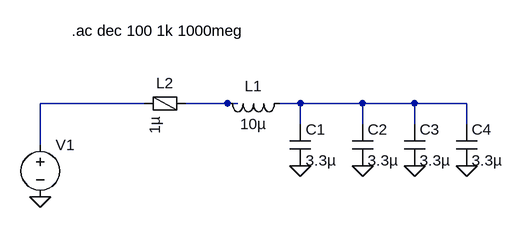
[diagram p0: schematic bias-tee.asc]
bias-tee.asc, the LTspice schematic file:
Version 4
SHEET 1 880 680
WIRE -48 304 -208 304
WIRE 80 304 16 304
WIRE 96 304 80 304
WIRE 192 304 160 304
WIRE 288 304 192 304
WIRE 368 304 288 304
WIRE 448 304 368 304
WIRE 192 336 192 304
WIRE 288 336 288 304
WIRE 368 336 368 304
WIRE 448 336 448 304
WIRE -208 368 -208 304
FLAG -208 448 0
FLAG 192 400 0
FLAG 288 400 0
FLAG 368 400 0
FLAG 448 400 0
SYMBOL voltage -208 352 R0
SYMATTR InstName V1
SYMATTR Value ""
SYMATTR Value2 AC 1
SYMBOL ind 176 288 R90
WINDOW 0 5 56 VBottom 2
WINDOW 3 32 56 VTop 2
SYMATTR InstName L1
SYMATTR Value 10µ
SYMATTR SpiceLine Ipk=830m Rser=380m Rpar=infin. Cpar=0 mfg="Murata" pn="LQH2HPN100MJRL"
SYMBOL FerriteBead -16 304 R90
WINDOW 0 -16 0 VBottom 2
SYMATTR InstName L2
SYMATTR Value 1µ
SYMATTR SpiceLine Ipk=1.5 Rser=90m Rpar=636 Cpar=836f mfg="Würth Elektronik" pn="74269262601 WE-TMSB 0603"
SYMBOL cap 176 336 R0
SYMATTR InstName C1
SYMATTR Value 3.3µ
SYMATTR SpiceLine Rser=4.2m Lser=300p mfg="Würth Elektronik" pn="885012107008 WCAP-CSGP 0805" type="X5R"
SYMBOL cap 272 336 R0
SYMATTR InstName C2
SYMATTR Value 3.3µ
SYMATTR SpiceLine Rser=4.2m Lser=300p mfg="Würth Elektronik" pn="885012107008 WCAP-CSGP 0805" type="X5R"
SYMBOL cap 352 336 R0
SYMATTR InstName C3
SYMATTR Value 3.3µ
SYMATTR SpiceLine Rser=4.2m Lser=300p mfg="Würth Elektronik" pn="885012107008 WCAP-CSGP 0805" type="X5R"
SYMBOL cap 432 336 R0
SYMATTR InstName C4
SYMATTR Value 3.3µ
SYMATTR SpiceLine Rser=4.2m Lser=300p mfg="Würth Elektronik" pn="885012107008 WCAP-CSGP 0805" type="X5R"
TEXT -160 192 Left 2 !.ac dec 100 1k 1000meg

The netlist it stands for:
* bias-tee.asc
V1 N001 0 AC 1
L1 N003 N002 10µ Ipk=830m Rser=380m Rpar=infin. Cpar=0 mfg="Murata" pn="LQH2HPN100MJRL"
L2 N002 N001 1µ Ipk=1.5 Rser=90m Rpar=636 Cpar=836f mfg="Würth Elektronik" pn="74269262601 WE-TMSB 0603"
C1 N003 0 3.3µ Rser=4.2m Lser=300p mfg="Würth Elektronik" pn="885012107008 WCAP-CSGP 0805" type="X5R"
C2 N003 0 3.3µ Rser=4.2m Lser=300p mfg="Würth Elektronik" pn="885012107008 WCAP-CSGP 0805" type="X5R"
C3 N003 0 3.3µ Rser=4.2m Lser=300p mfg="Würth Elektronik" pn="885012107008 WCAP-CSGP 0805" type="X5R"
C4 N003 0 3.3µ Rser=4.2m Lser=300p mfg="Würth Elektronik" pn="885012107008 WCAP-CSGP 0805" type="X5R"
.ac dec 100 1k 1000meg
.backanno
.end